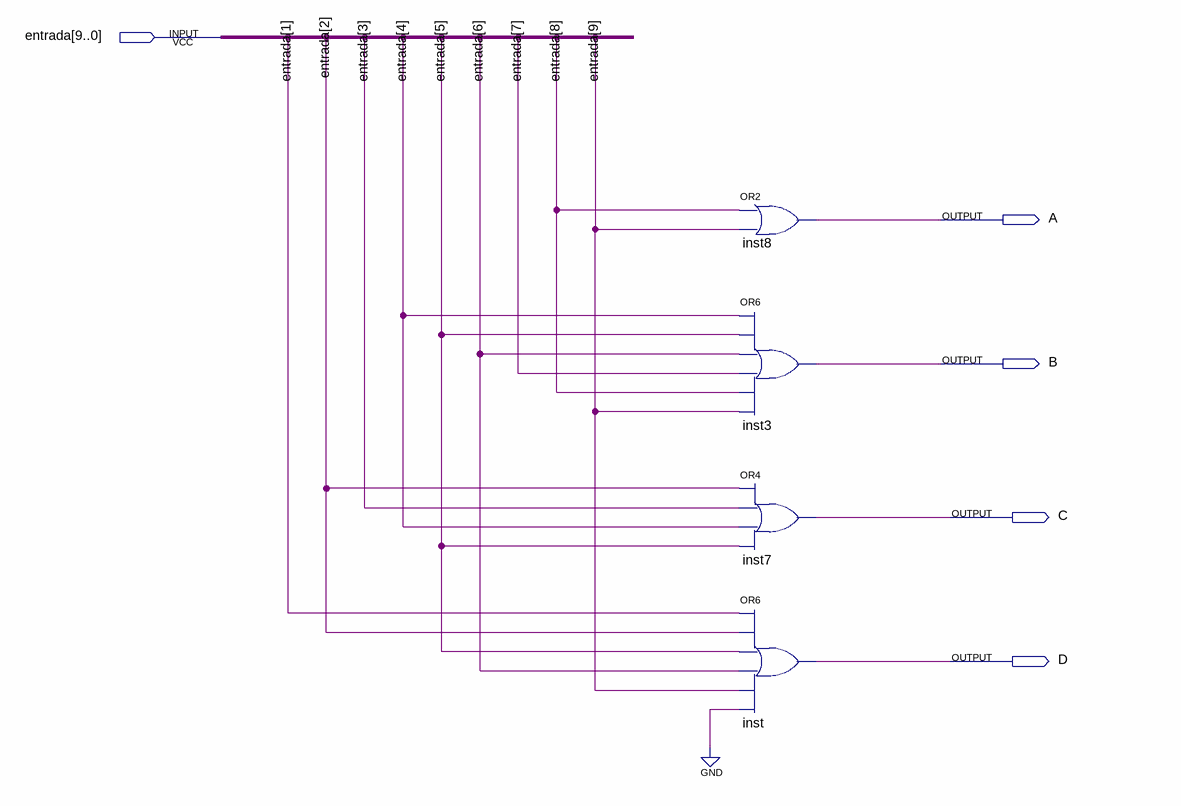
[diagram p0: schematic sheet]
// Quartus schematic codificador.bdf as structural Verilog: 4 symbols, 5 pins
module codificador (
  input  [9:0] entrada,
  output A,
  output B,
  output C,
  output D
);

  or inst8 (A, entrada[8], entrada[9]);
  or inst3 (B, entrada[4], entrada[5], entrada[6], entrada[7], entrada[8], entrada[9]);
  or inst7 (C, entrada[2], entrada[3], entrada[4], entrada[5]);
  or inst (D, entrada[1], entrada[2], entrada[5], entrada[6], entrada[9], 1'b0);
endmodule
